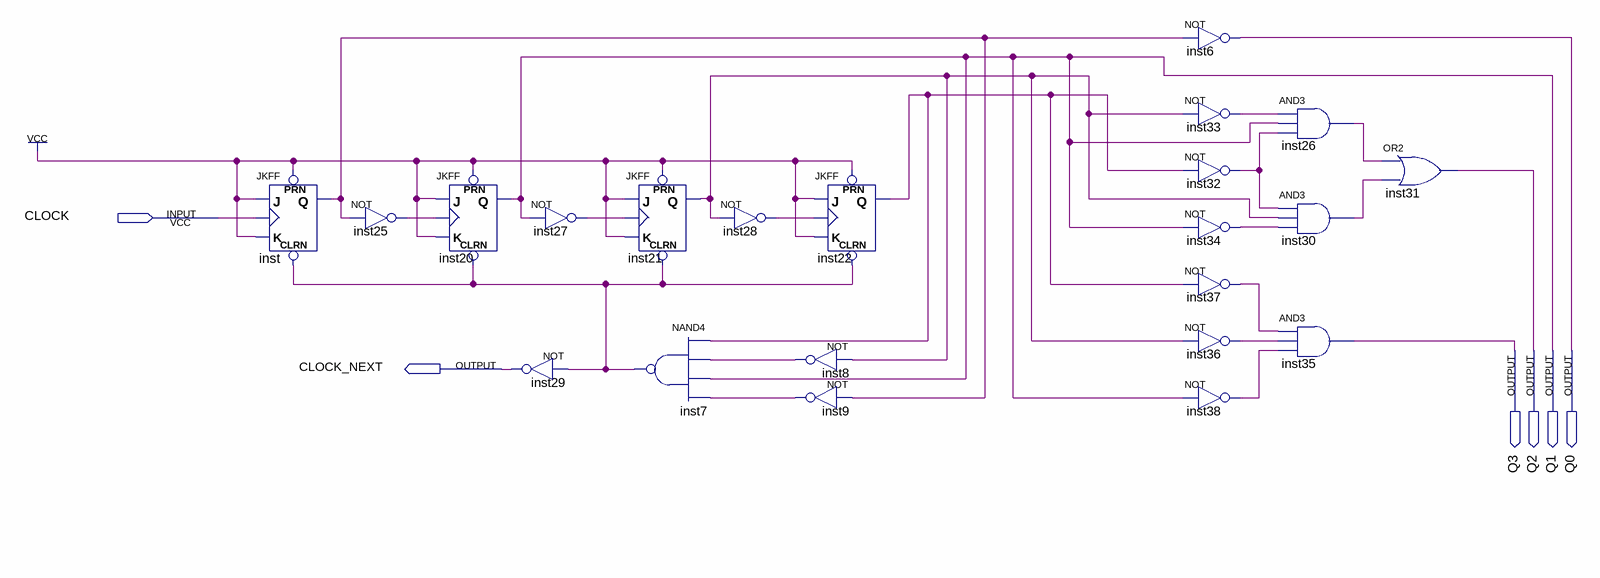
[diagram p0: schematic sheet]
// Quartus schematic decade_counter_down.bdf as structural Verilog: 22 symbols, 6 pins
module decade_counter_down (
  input  CLOCK,
  output Q3,
  output Q2,
  output Q1,
  output Q0,
  output CLOCK_NEXT
);

  wire inst7_out, inst8_out, inst9_out, inst21_q, inst22_q, inst25_out, inst26_out, inst27_out, inst28_out,
       inst30_out, inst32_out, inst33_out, inst34_out, inst36_out, inst37_out, inst38_out, inst_q;

  JKFF inst (.PRN(1'b1), .CLRN(inst7_out), .K(1'b1), .J(1'b1), .CLK(CLOCK), .Q(inst_q));
  not inst25 (inst25_out, inst_q);
  JKFF inst20 (.PRN(1'b1), .CLRN(inst7_out), .K(1'b1), .J(1'b1), .CLK(inst25_out), .Q(Q1));
  not inst27 (inst27_out, Q1);
  not inst29 (CLOCK_NEXT, inst7_out);
  JKFF inst21 (.PRN(1'b1), .CLRN(inst7_out), .K(1'b1), .J(1'b1), .CLK(inst27_out), .Q(inst21_q));
  nand inst7 (inst7_out, inst22_q, inst8_out, Q1, inst9_out);
  not inst28 (inst28_out, inst21_q);
  JKFF inst22 (.PRN(1'b1), .CLRN(inst7_out), .K(1'b1), .J(1'b1), .CLK(inst28_out), .Q(inst22_q));
  not inst8 (inst8_out, inst21_q);
  not inst9 (inst9_out, inst_q);
  not inst6 (Q0, inst_q);
  not inst33 (inst33_out, inst21_q);
  not inst32 (inst32_out, inst22_q);
  not inst34 (inst34_out, Q1);
  not inst37 (inst37_out, inst22_q);
  not inst36 (inst36_out, inst21_q);
  not inst38 (inst38_out, Q1);
  and inst26 (inst26_out, inst33_out, Q1, inst32_out);
  and inst30 (inst30_out, inst32_out, inst21_q, inst34_out);
  and inst35 (Q3, inst37_out, inst36_out, inst38_out);
  or inst31 (Q2, inst26_out, inst30_out);
endmodule
